# EAGLE design LED_Driver_BrkOut (EAGLE 8.6.0)
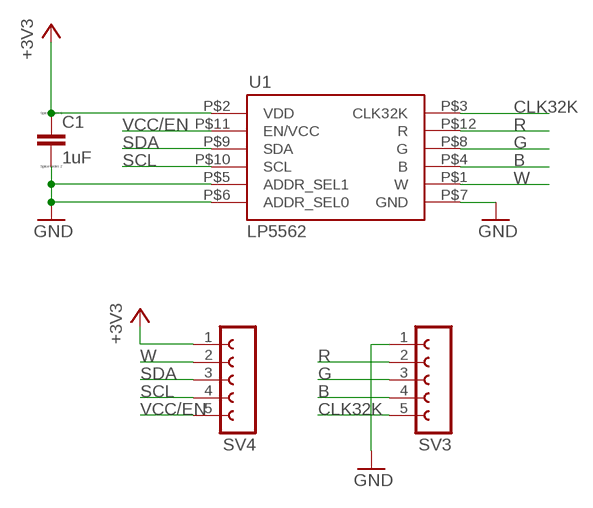
[diagram p0: schematic, sheet 1]

## Parts
C1  1uF  CC0603  [C0603]
SV3  FE05-1  [FE05-1]
SV4  FE05-1  [FE05-1]
U1  LP5562  LP5562LP5562  [YQE_12-PIN_DSBGA]

## Nets
+3V3: C1.1 SV4.1 U1.P$2(VDD)
B: SV3.4 U1.P$4(B)
CLK32K: SV3.5 U1.P$3(CLK32K)
G: SV3.3 U1.P$8(G)
GND: C1.2 SV3.1 U1.P$5(ADDR_SEL1) U1.P$6(ADDR_SEL0) U1.P$7(GND)
R: SV3.2 U1.P$12(R)
SCL: SV4.4 U1.P$10(SCL)
SDA: SV4.3 U1.P$9(SDA)
VCC/EN: SV4.5 U1.P$11(EN/VCC)
W: SV4.2 U1.P$1(W)

## Library data of the parts
C1 = eagle-ltspice:C: CAPACITOR, European symbol; SPICEMODEL: NONE; SPICEPREFIX: C
SV3 SV4 = con-lsta:FE05-1: FEMALE HEADER; OC_FARNELL: unknown; OC_NEWARK: unknown
U1 = led_headband:LP5562

## Board
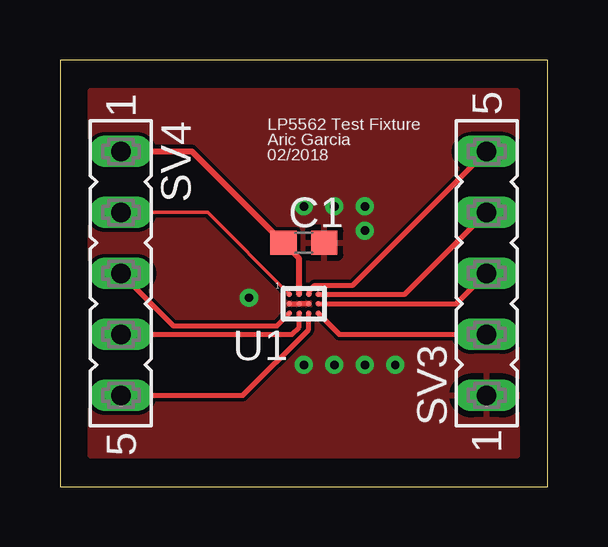
[diagram p1: board, top side]
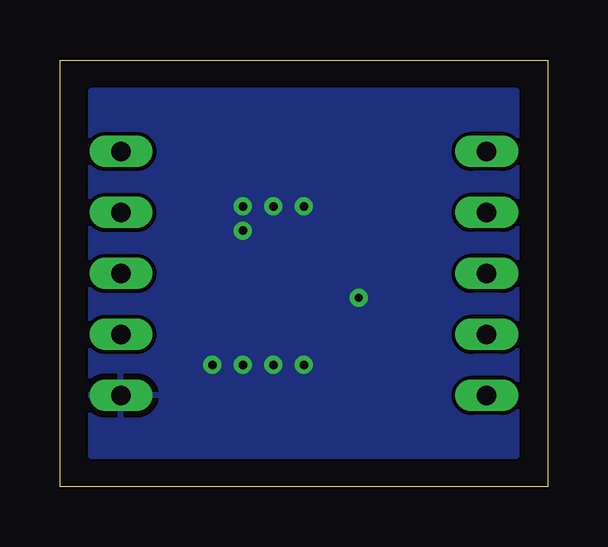
[diagram p2: board, bottom side, seen from below]

Size 20.32 x 17.78 mm. Coordinates in mm from the lower left corner, seen from the top.
Outline: 0,0 20.32,0 20.32,17.78 0,17.78 0,0
Copper layers (1*16): Top 0.035mm / dielectric 1.5mm / Bottom 0.035mm
Design rules "default *": minimum track width 6mil, minimum drill 0.35mm, track to track 6mil, track to pad 6mil, pad to pad 6mil, via to via 6mil, smd to smd 6mil, copper to edge 40mil, drill to drill 6mil, minimum pad ring 10mil, minimum via ring 8mil, stop-mask expansion 4mil, vias tented up to drill 14mil, thermal gap 10mil

### Footprints (pad centres in the part's own frame; a part is rotated, then mirrored left to right if it is on the bottom)
C0603 = smd 1.1 x 1: 1 -0.85,0; 2 0.85,0
FE05-1 = drill 0.813 long: 1 -5.08,0; 2 -2.54,0; 3 0,0; 4 2.54,0; 5 5.08,0
YQE_12-PIN_DSBGA = smd 0.225 x 0.225: P$1 -0.6,0.4; P$2 -0.2,0.4; P$3 0.2,0.4; P$4 0.6,0.4; P$5 -0.6,0; P$6 -0.2,0; P$7 0.2,0; P$8 0.6,0; P$9 -0.6,-0.4; P$10 -0.2,-0.4; P$11 0.2,-0.4; P$12 0.6,-0.4

### Placement (x,y rotation side)
C1  10.16,10.16 0 top
SV3  17.78,8.89 90 top
SV4  2.54,8.89 270 top
U1  10.16,7.62 0 top

### Tracks (layer width: path | path; a pad name or v marks a point on that pad's centre or on a via)
+3V3
  Top 0.254: SV4.1 5.5,13.97 C1.1 9.96,9.51 U1.P$2
B
  Top 0.203: U1.P$4 14.37,8.02 SV3.4
CLK32K
  Top 0.203: U1.P$3 10.39,8.05 10.39,8.17 10.61,8.39 12.2,8.39 SV3.5
G
  Top 0.203: U1.P$8 16.51,7.62 SV3.3
GND  (via drill 0.35)
  Top 0.203: U1.P$7 U1.P$6 U1.P$5
  other vias: 7.87,7.87 10.16,11.68 11.43,11.68 12.7,11.68 12.7,10.67 13.97,5.08 12.7,5.08 11.43,5.08 10.16,5.08
  pour Bottom: 1.27,16.51 19.05,16.51 19.05,1.27 1.27,1.27
  pour Top: 1.27,16.51 19.05,16.51 19.05,1.27 1.27,1.27
R
  Top 0.203: U1.P$12 11.63,6.35 SV3.2
SCL
  Top 0.203: SV4.4 9.66,6.35 9.96,6.65 U1.P$10
SDA
  Top 0.203: SV4.3 4.72,6.71 9.05,6.71 U1.P$9
VCC/EN
  Top 0.203: SV4.5 7.62,3.81 10.36,6.55 U1.P$11
W
  Top 0.152: U1.P$1 6.15,11.43 SV4.2

### Text on the board
tPlace: Aric Garcia | LP5562 Test Fixture | 02/2018